# EAGLE design qtip_s1 (EAGLE 9.3.1)
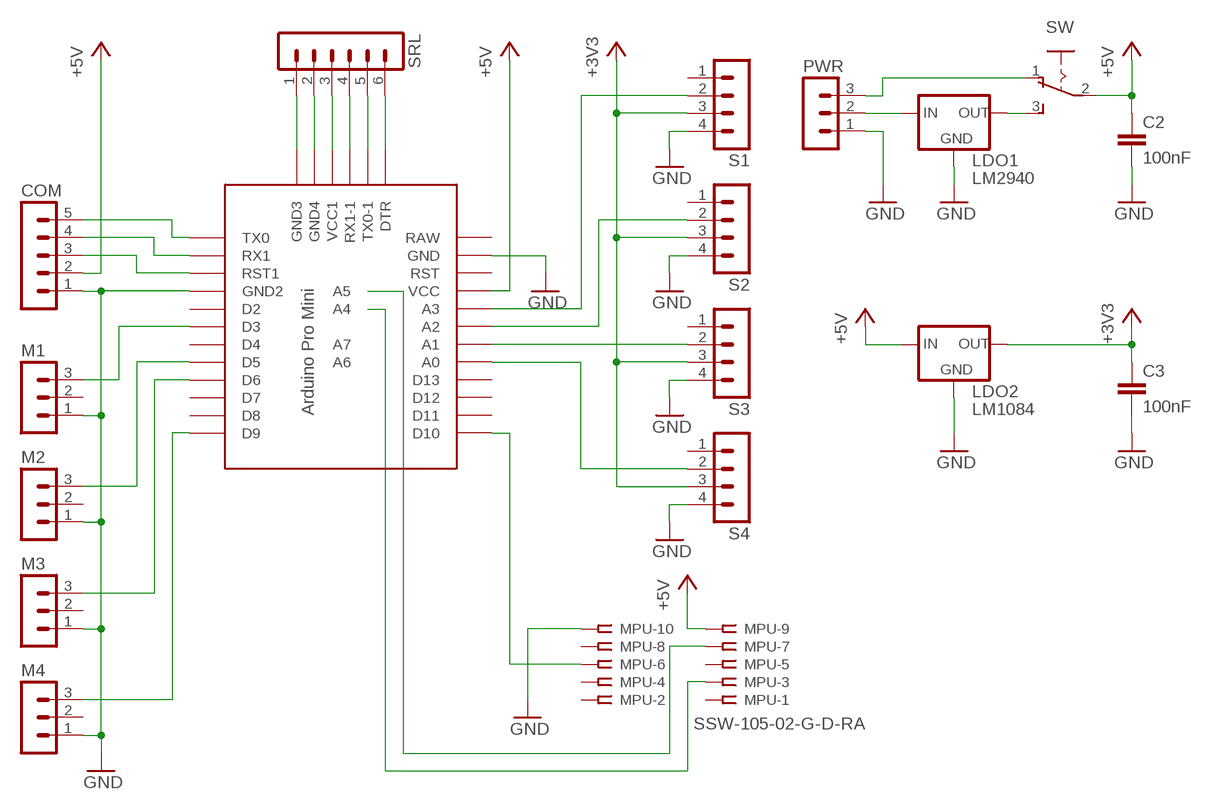
[diagram p0: schematic, sheet 1]

## Parts
C2  100nF  C-EU025-024X044  [C025-024X044]
C3  100nF  C-EU025-024X044  [C025-024X044]
COM  MA05-1  [MA05-1]
LDO1  LM2940  V_REG_LD1117VXX  [78XXL]
LDO2  LM1084  V_REG_LD1117VXX  [78XXL]
M1  MA03-1  [MA03-1]
M2  MA03-1  [MA03-1]
M3  MA03-1  [MA03-1]
M4  MA03-1  [MA03-1]
MPU  SSW-105-02-G-D-RA  [SSW-105-02-G-D-RA]
PWR  MA03-1  [MA03-1]
S1  MA04-1  [MA04-1]
S2  MA04-1  [MA04-1]
S3  MA04-1  [MA04-1]
S4  MA04-1  [MA04-1]
SRL  MA06-1  [MA06-1]
SW  255SB  [255SB]
ÀPM  PRO-MINI-2  [PRO-MINI-2]

## Nets
+3V3: C3.1 LDO2.GND(OUT) S1.3 S2.3 S3.3 S4.3
+5V: C2.1 COM.2 LDO2.OUT(IN) MPU.9 SW.2(P) ÀPM.VCC
GND: C2.2 C3.2 COM.1 LDO1.IN(GND) LDO2.IN(GND) M1.1 M2.1 M3.1 M4.1 MPU.10 PWR.1 S1.4 S2.4 S3.4 S4.4 ÀPM.GND ÀPM.GND1(GND2)
MV2: M2.3 ÀPM.D5
N$1: MPU.7 ÀPM.A5
N$2: MPU.3 ÀPM.A4
N$3: S1.2 ÀPM.A3
N$4: MPU.6 ÀPM.D10
N$5: S4.2 ÀPM.A0
N$6: M1.3 ÀPM.D3
N$7: M4.3 ÀPM.D9
N$8: M3.3 ÀPM.D6
N$9: LDO1.OUT(IN) PWR.2
N$10: SRL.1 ÀPM.GND2(GND3)
N$11: COM.5 ÀPM.TX0
N$12: COM.4 ÀPM.RX1
N$13: COM.3 ÀPM.RST1
N$14: SRL.2 ÀPM.GND3(GND4)
N$15: S3.2 ÀPM.A1
N$16: SRL.3 ÀPM.VCC1
N$17: S2.2 ÀPM.A2
N$18: SRL.4 ÀPM.RX1-1
N$19: LDO1.GND(OUT) SW.3(S)
N$20: SRL.5 ÀPM.TX0-1
N$21: PWR.3 SW.1(O)
N$23: SRL.6 ÀPM.DTR
Unconnected: M1.2 M2.2 M3.2 M4.2 MPU.1 MPU.2 MPU.4 MPU.5 MPU.8 S1.1 S2.1 S3.1 S4.1 ÀPM.A6 ÀPM.A7 ÀPM.D2 ÀPM.D4 ÀPM.D7 ÀPM.D8 ÀPM.D11 ÀPM.D12 ÀPM.D13 ÀPM.RAW ÀPM.RST

## Library data of the parts
C2 C3 = rcl:C-EU: CAPACITOR, European symbol; SPICEPREFIX: C
COM = con-lstb:MA05-1: PIN HEADER; OC_FARNELL: unknown; OC_NEWARK: unknown; SPICEPREFIX: X
LDO1 LDO2 = SparkFun-IC-Power:V_REG_LD1117VXX: LD1117VXX voltage regulator. We carry the 3.3V version (COM-00526) in TO-220 package.
M1-M4 PWR = con-lstb:MA03-1: PIN HEADER; OC_FARNELL: unknown; OC_NEWARK: unknown
MPU = con-samtec:SSW-105-02-G: THROUGH-HOLE .025" SQ POST SOCKET Source: Samtec SSW.pdf; MF: Samtec Inc.; MPN: SSW-105-02-G-D-RA; OC_FARNELL: unknown; OC_NEWARK: 18M6953
S1-S4 = con-lstb:MA04-1: PIN HEADER; OC_FARNELL: unknown; OC_NEWARK: unknown
SRL = con-lstb:MA06-1: PIN HEADER; OC_FARNELL: unknown; OC_NEWARK: unknown
SW = switch:255SB: SLIDING SWITCH Distributor Buerklin, 11G810
ÀPM = Arduino-clone:PRO-MINI-2: Arduino Pro Mini Layout 2 Sparkfun.com

## Net classes
0 default: width 0.203 mm

## Board
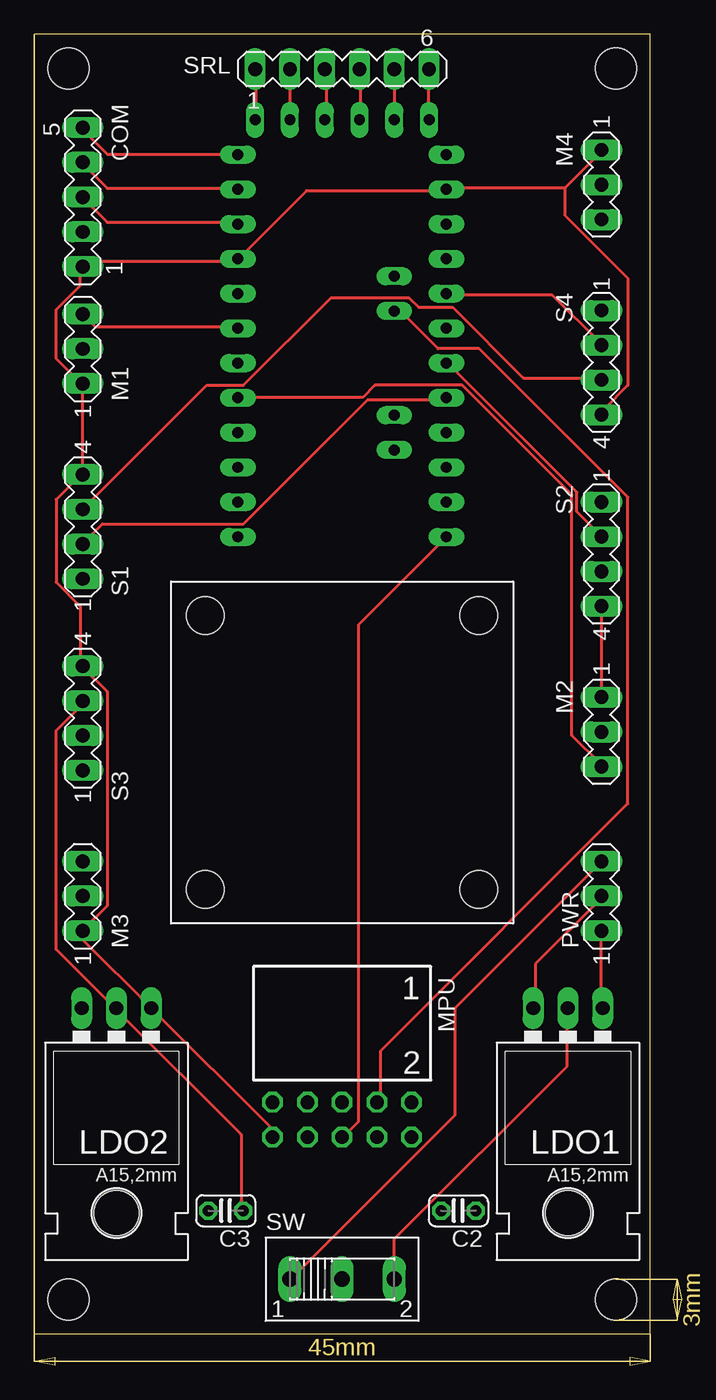
[diagram p1: board, top side]
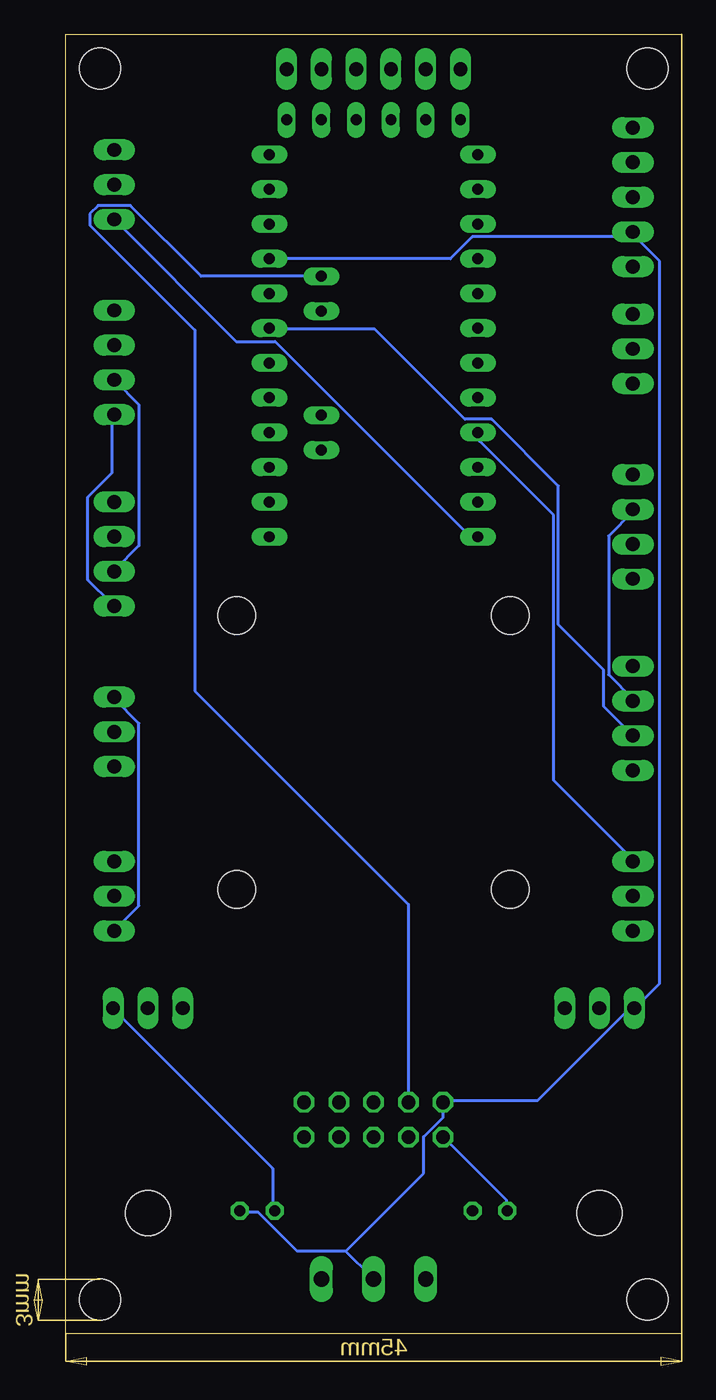
[diagram p2: board, bottom side, seen from below]

Size 45 x 95 mm. Coordinates in mm from the lower left corner, seen from the top.
Outline: 0,0 45,0 45,95 0,95 0,0
Copper layers (1*16): Top 0.035mm / dielectric 1.5mm / Bottom 0.035mm
Design rules "default": minimum track width 6mil, minimum drill 0.35mm, track to track 6mil, track to pad 6mil, pad to pad 6mil, via to via 6mil, smd to smd 6mil, copper to edge 40mil, drill to drill 6mil, minimum pad ring 10mil, minimum via ring 8mil, stop-mask expansion 4mil, vias tented up to drill 0mil, thermal gap 10mil
Holes 3 mm at 2.5,2.5 42.5,2.5 2.5,92.5 42.5,92.5
Holes 2.75 mm at 12.5,52.5 32.5,52.5 32.5,32.5 12.5,32.5

### Footprints (pad centres in the part's own frame; a part is rotated, then mirrored left to right if it is on the bottom)
C025-024X044 = drill 0.813 octagon: 1 -1.27,0; 2 1.27,0
MA05-1 = drill 1.016 long: 1 -5.08,0; 2 -2.54,0; 3 0,0; 4 2.54,0; 5 5.08,0
78XXL = drill 1.016 long: GND 0,-3.81; IN -2.54,-3.81; OUT 2.54,-3.81 | hole 3.302: 0,11.176
MA03-1 = drill 1.016 long: 1 -2.54,0; 2 0,0; 3 2.54,0
SSW-105-02-G-D-RA = drill 1 pad 1.5 octagon: 1 -5.08,1.524; 2 -5.08,4.064; 3 -2.54,1.524; 4 -2.54,4.064; 5 0,1.524; 6 0,4.064; 7 2.54,1.524; 8 2.54,4.064; 9 5.08,1.524; 10 5.08,4.064
MA04-1 = drill 1.016 long: 1 -3.81,0; 2 -1.27,0; 3 1.27,0; 4 3.81,0
MA06-1 = drill 1.016 long: 1 -6.35,0; 2 -3.81,0; 3 -1.27,0; 4 1.27,0; 5 3.81,0; 6 6.35,0
255SB = drill 1.118 long: 1 -3.81,0; 2 0,0; 3 3.81,0
PRO-MINI-2 = drill 0.8 long: A0 6.35,2.54; A1 6.35,0; A2 6.35,-2.54; A3 6.35,-5.08; A4 2.54,1.27; A5 2.54,3.81; A6 2.54,-8.89; A7 2.54,-6.35; D2 -8.89,2.54; D3 -8.89,0; D4 -8.89,-2.54; D5 -8.89,-5.08; D6 -8.89,-7.62; D7 -8.89,-10.16; D8 -8.89,-12.7; D9 -8.89,-15.24; D10 6.35,-15.24; D11 6.35,-12.7; D12 6.35,-10.16; D13 6.35,-7.62; DTR 5.08,15.24; GND 6.35,10.16; GND1 -8.89,5.08; GND2 -7.62,15.24; GND3 -5.08,15.24; RAW 6.35,12.7; RST 6.35,7.62; RST1 -8.89,7.62; RX1 -8.89,10.16; RX1-1 0,15.24; TX0 -8.89,12.7; TX0-1 2.54,15.24; VCC 6.35,5.08; VCC1 -2.54,15.24

### Placement (x,y rotation side)
C2  31,9 180 top
C3  14,9 180 top
COM  3.55,83.09 90 top
LDO1  39,20 180 top
LDO2  6,20 180 top
M1  3.55,72 90 top
M2  41.45,44 270 top
M3  3.55,32 90 top
M4  41.45,84 270 top
MPU  22.5,18.45 180 top
PWR  41.45,32 90 top
S1  3.55,59 90 top
S2  41.45,57 270 top
S3  3.55,45 90 top
S4  41.45,71 270 top
SRL  22.5,92.45 0 top
SW  22.5,4 0 top
ÀPM  23.77,73.5 0 top

### Tracks (layer width: path | path; a pad name or v marks a point on that pad's centre or on a via)
+3V3
  Top 0.203: C3.1 15.11,9.07 15.11,14.58 6.04,23.65 LDO2.GND 5.87,23.82 1.6,28.09 1.6,44.09 3.38,45.87 3.38,46.23 S3.3 | S4.3 41.43,69.88 35.74,69.88 30.58,75.03 28.09,75.03 27.38,75.74 21.69,75.74 15.29,69.34 12.62,69.34 S1.3
  Bottom 0.203: S2.3 41.43,55.83 39.65,57.61 39.65,67.92 41.43,69.7 S4.3 | S3.3 3.56,46.41 5.33,48.18 5.33,58.32 3.56,60.1 S1.3
+5V
  Bottom 0.203: ÀPM.VCC 30.05,78.59 16.89,78.59 15.29,80.19 3.91,80.19 COM.2 3.38,80.54 3.38,80.19 1.6,78.41 1.6,25.6 3.38,23.82 LDO2.OUT 3.56,23.65 3.91,23.65 10.49,17.07 17.25,17.07 MPU.9 17.42,16.89 17.42,15.82 18.85,14.4 18.85,11.73 24.54,6.04 | 24.54,6.04 28.09,6.04 30.94,8.89 32.18,8.89 C2.1 | 24.54,6.04 22.58,4.09 SW.2
GND
  Top 0.203: M2.1 41.43,46.58 41.43,53.16 S2.4 | PWR.1 41.43,29.34 41.43,23.82 LDO1.IN | MPU.10 17.25,14.4 17.25,15.11 8.71,23.65 LDO2.IN 8.53,23.82 3.56,28.8 3.56,29.34 M3.1 3.56,29.52 5.33,31.29 5.33,46.94 3.56,48.72 S3.4 3.38,48.9 3.38,53.16 1.6,54.94 1.6,60.98 3.38,62.76 S1.4 3.56,62.94 3.56,69.34 M1.1 3.38,69.52 1.6,71.3 1.6,74.85 3.38,76.63 3.38,77.88 COM.1 3.56,78.05 3.91,78.41 14.76,78.41 ÀPM.GND1 14.94,78.59 19.91,83.57 30.05,83.57 ÀPM.GND 30.23,83.74 38.76,83.74 | 38.76,83.74 41.43,86.41 M4.1 | 38.76,83.74 38.76,81.79 43.38,77.17 43.38,69.34 41.6,67.56 41.6,67.21 S4.4
  Bottom 0.203: S4.4 41.6,67.03 41.6,62.94 43.38,61.16 43.38,55.12 41.6,53.34 S2.4 | C2.2 29.87,9.07 29.87,12.09 41.43,23.65 LDO1.IN | M2.1 41.43,46.41 39.65,44.63 39.65,31.29 41.43,29.52 PWR.1 | C3.2 12.8,9.07 12.8,9.78 17.25,14.22 MPU.10
MV2
  Top 0.203: ÀPM.D5 14.94,68.45 24,68.45 24.89,69.34 31.29,69.34 39.29,61.34 39.29,43.74 41.43,41.6 M2.3
N$1
  Bottom 0.203: ÀPM.A5 35.1,77.31 40.27,82.48 42.63,82.48 43.23,81.88 43.23,81.04 35.56,73.37 35.56,46.99 19.96,31.39 MPU.7
N$2
  Top 0.203: ÀPM.A4 26.31,74.68 26.85,74.68 29.52,72.01 32.54,72.01 43.38,61.16 43.38,38.76 25.32,20.7 25.32,17.32 25.07,17.07 MPU.3
N$3
  Top 0.203: ÀPM.A3 30.05,68.28 24.36,68.28 15.29,59.21 4.98,59.21 3.56,57.78 S1.2
N$4
  Top 0.203: ÀPM.D10 23.7,51.84 23.7,15.52 22.58,14.4 MPU.6
N$5
  Top 0.203: ÀPM.A0 30.23,75.92 37.87,75.92 41.43,72.36 S4.2
N$6
  Top 0.203: ÀPM.D3 14.76,73.61 4.45,73.61 3.56,74.5 M1.3
N$7
  Bottom 0.203: ÀPM.D9 14.94,58.32 15.47,58.32 29.69,72.54 32.54,72.54 41.43,81.43 M4.3
N$8
  Bottom 0.203: ÀPM.D6 14.76,65.79 14.76,65.25 9.35,59.84 9.35,40.46 3.56,34.67 M3.3
N$9
  Top 0.203: LDO1.OUT 36.63,23.82 36.63,27.03 41.43,31.83 PWR.2
N$10
  Top 0.203: ÀPM.GND2 16.18,88.9 16.18,92.28 SRL.1
N$11
  Top 0.203: ÀPM.TX0 14.76,86.23 5.33,86.23 3.56,88.01 COM.5
N$12
  Top 0.203: ÀPM.RX1 14.76,83.74 5.33,83.74 3.56,85.52 COM.4
N$13
  Top 0.203: ÀPM.RST1 14.76,81.25 5.33,81.25 3.56,83.03 COM.3
N$14
  Top 0.203: ÀPM.GND3 18.67,88.9 18.67,92.28 SRL.2
N$15
  Bottom 0.203: ÀPM.A1 30.05,73.43 22.4,73.43 15.82,66.85 13.87,66.85 8.99,61.98 8.99,51.84 5.69,48.54 5.69,45.87 S3.2
N$16
  Top 0.203: ÀPM.VCC1 21.34,88.9 21.34,92.28 SRL.3
N$17
  Top 0.203: ÀPM.A2 30.23,70.94 39.65,61.52 39.65,60.1 41.43,58.32 S2.2
N$18
  Top 0.203: ÀPM.RX1-1 23.82,88.9 23.82,92.28 SRL.4
N$19
  Top 0.203: LDO1.GND 38.94,23.65 38.94,19.56 26.31,6.93 26.31,4.09 SW.3
N$20
  Top 0.203: ÀPM.TX0-1 26.31,88.9 26.31,92.28 SRL.5
N$21
  Top 0.203: PWR.3 41.43,34.49 30.76,23.82 30.76,16 18.85,4.09 SW.1
N$23
  Top 0.203: ÀPM.DTR 28.8,88.9 28.8,92.28 SRL.6